# Altium schematic sheet LCD.SchDoc: 24 Bit TFT LCD
size A4; SheetNumber: 7; SheetTotal: 11; SheetSize: A4
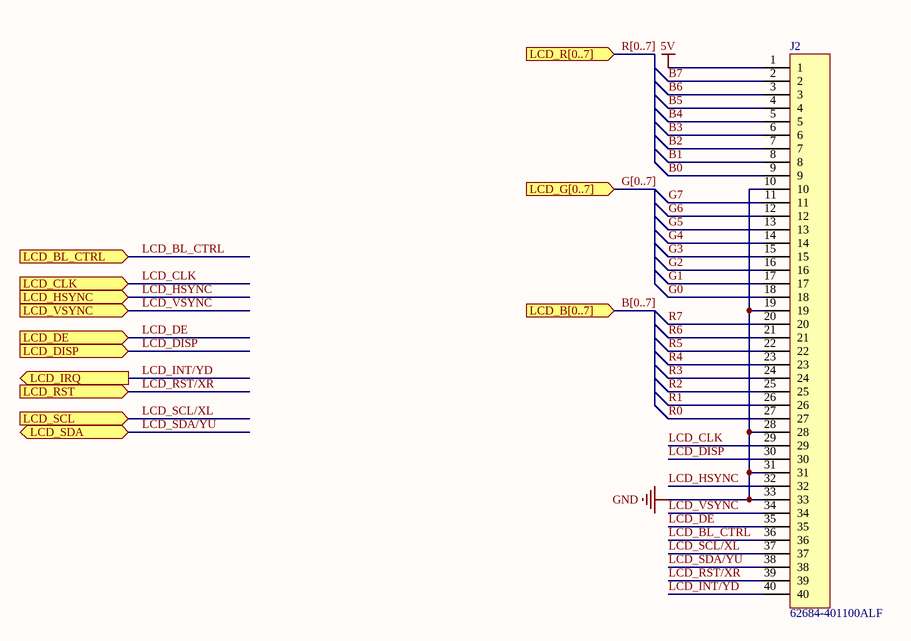
[diagram p0: LCD.SchDoc]

## Parts
J2  62684-401100ALF  [fpc-40]

## Ports
LCD_B[0..7] (in), LCD_BL_CTRL (in), LCD_CLK (in), LCD_DE (in), LCD_DISP (in), LCD_G[0..7] (in), LCD_HSYNC (in), LCD_IRQ (out), LCD_R[0..7] (in), LCD_RST (in), LCD_SCL (in), LCD_SDA (bidir), LCD_VSYNC (in)

## Nets
5V: J2.1
GND: J2.10 J2.19 J2.28 J2.31 J2.33
B0: J2.9
B1: J2.8
B2: J2.7
B3: J2.6
B4: J2.5
B5: J2.4
B6: J2.3
B7: J2.2
G0: J2.18
G1: J2.17
G2: J2.16
G3: J2.15
G4: J2.14
G5: J2.13
G6: J2.12
G7: J2.11
LCD_BL_CTRL: J2.36 ; port LCD_BL_CTRL
LCD_CLK: J2.29 ; port LCD_CLK
LCD_DE: J2.35 ; port LCD_DE
LCD_DISP: J2.30 ; port LCD_DISP
LCD_HSYNC: J2.32 ; port LCD_HSYNC
LCD_INT/YD: J2.40 ; port LCD_IRQ
LCD_RST/XR: J2.39 ; port LCD_RST
LCD_SCL/XL: J2.37 ; port LCD_SCL
LCD_SDA/YU: J2.38 ; port LCD_SDA
LCD_VSYNC: J2.34 ; port LCD_VSYNC
R0: J2.27
R1: J2.26
R2: J2.25
R3: J2.24
R4: J2.23
R5: J2.22
R6: J2.21
R7: J2.20

## Buses and harness runs
bus B[0..7] = port LCD_B[0..7]
bus G[0..7] = port LCD_G[0..7]
bus R[0..7] = port LCD_R[0..7]

## Notes on the sheet
- Title:
- Size:
- Project:
- Revision:
- Sheet
- of
- Date:
- YıLDıZ IoT
- Elperek Mahallesi
- Saray Sokak, No:12
- SAKARYA / TURKEY
- File:

## Library data of the parts
J2 = FPC-40: Connector; Manufacturer: Amphenol FCI; Actuator Material: Glass,Thermoplastic; Number of Positions: 40; Current Rating: 500mA; Voltage Rating: 50V; Contact Location: Bottom; Insulation Resistance: 100MR; Gender: Receptacle; Contact Resistance: 30mR; Pitch: 0.5mm; Supplier 1: Digi-Key; Supplier Part Number 1: 609-1195-1-ND; Manufacturer Part Number: 62684-401100ALF; Stock 1: 13351; Pricing 1: 1 = 0,97000, 10 = 0,85600, 25 = 0,80600, 50 = 0,77240, 100 = 0,73880, 250 = 0,67168, 500 = 0,60450, 1000 = 0,53733 (USD); RoHS: Yes; Mount: Surface Mount; Housing Material: Thermoplastic; Housing Color: Beige; Contact Material: Bronze; Contact Plating: Gold; Min Operating Temperature: -55°C; Max Operating Temperature: 85°C; Termination: Solder; Packaging: Tape and Reel; Orientation: Right Angle; Number of Contacts: 40; Max Voltage Rating (AC): 50V; Max Voltage Rating (DC): 50V; Number of Rows: 1; Package Quantity: 2000; Length: 25.5mm; Depth: 5mm; Width: 5mm; Flammability Rating: UL94 V-0; REACH SVHC: No SVHC; Lead Free: Lead Free; ComponentLink1URL: https://datasheet.ciiva.com/25631/0900766b8118e51f-25631168.pdf?src-supplier=RSComponents; ComponentLink1Description: https://datasheet.ciiva.com/25631/0900766b8118e51f-25631168.pdf?src-supplier=RSComponents; ComponentLink2URL: https://datasheet.ciiva.com/3112/62684-3112007.pdf?src-supplier=Avnet; ComponentLink2Description: https://datasheet.ciiva.com/3112/62684-3112007.pdf?src-supplier=Avnet; ComponentLink3URL: https://datasheet.ciiva.com/670/62684-670200.pdf?src-supplier=Digi-Key; ComponentLink3Description: https://datasheet.ciiva.com/670/62684-670200.pdf?src-supplier=Digi-Key; ComponentLink4URL: https://datasheet.ciiva.com/670/62684-670201.pdf?src-supplier=Digi-Key; ComponentLink4Description: https://datasheet.ciiva.com/670/62684-670201.pdf?src-supplier=Digi-Key; ComponentLink5URL: https://datasheet.ciiva.com/670/62684-670202.pdf?src-supplier=Digi-Key; ComponentLink5Description: https://datasheet.ciiva.com/670/62684-670202.pdf?src-supplier=Digi-Key; ComponentLink6URL: https://datasheet.ciiva.com/16659/62684-16659882.pdf?src-supplier=Avnet+Europe; ComponentLink6Description: https://datasheet.ciiva.com/16659/62684-16659882.pdf?src-supplier=Avnet+Europe; ComponentLink7URL: https://datasheet.ciiva.com/16709/70236840-16709916.pdf?src-supplier=Allied+Electronics; ComponentLink7Description: https://datasheet.ciiva.com/16709/70236840-16709916.pdf?src-supplier=Allied+Electronics; ComponentLink8URL: https://datasheet.ciiva.com/3112/62684-3112397.pdf?src-supplier=Avnet; ComponentLink8Description: https://datasheet.ciiva.com/3112/62684-3112397.pdf?src-supplier=Avnet; ComponentLink9URL: https://datasheet.ciiva.com/5772/62684-5772782.pdf?src-supplier=Farnell; ComponentLink9Description: https://datasheet.ciiva.com/5772/62684-5772782.pdf?src-supplier=Farnell